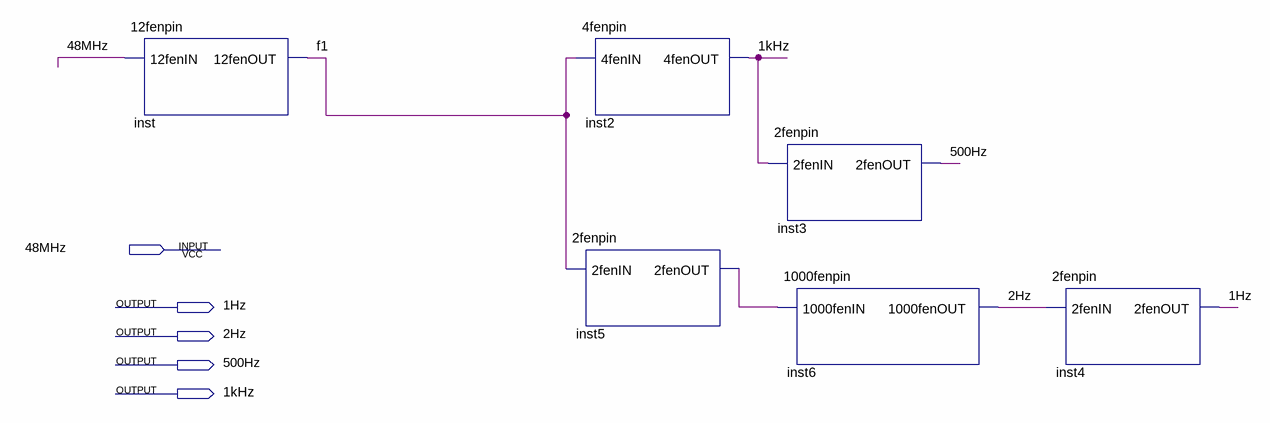
[diagram p0: schematic sheet]
// Quartus schematic fenpin.bdf as structural Verilog: 6 symbols, 5 pins
module fenpin (
  input  \48MHz ,
  output \1Hz ,
  output \2Hz ,
  output \500Hz ,
  output \1kHz 
);

  wire f1, inst5_2fenout;

  \12fenpin  inst (.\12fenIN (\48MHz ), .\12fenOUT (f1));
  \2fenpin  inst5 (.\2fenIN (f1), .\2fenOUT (inst5_2fenout));
  \4fenpin  inst2 (.\4fenIN (f1), .\4fenOUT (\1kHz ));
  \2fenpin  inst3 (.\2fenIN (\1kHz ), .\2fenOUT (\500Hz ));
  \1000fenpin  inst6 (.\1000fenIN (inst5_2fenout), .\1000fenOUT (\2Hz ));
  \2fenpin  inst4 (.\2fenIN (\2Hz ), .\2fenOUT (\1Hz ));
endmodule
